# Altium schematic sheet Low Distortion Oscillator.Notch1.SchDoc
size A4
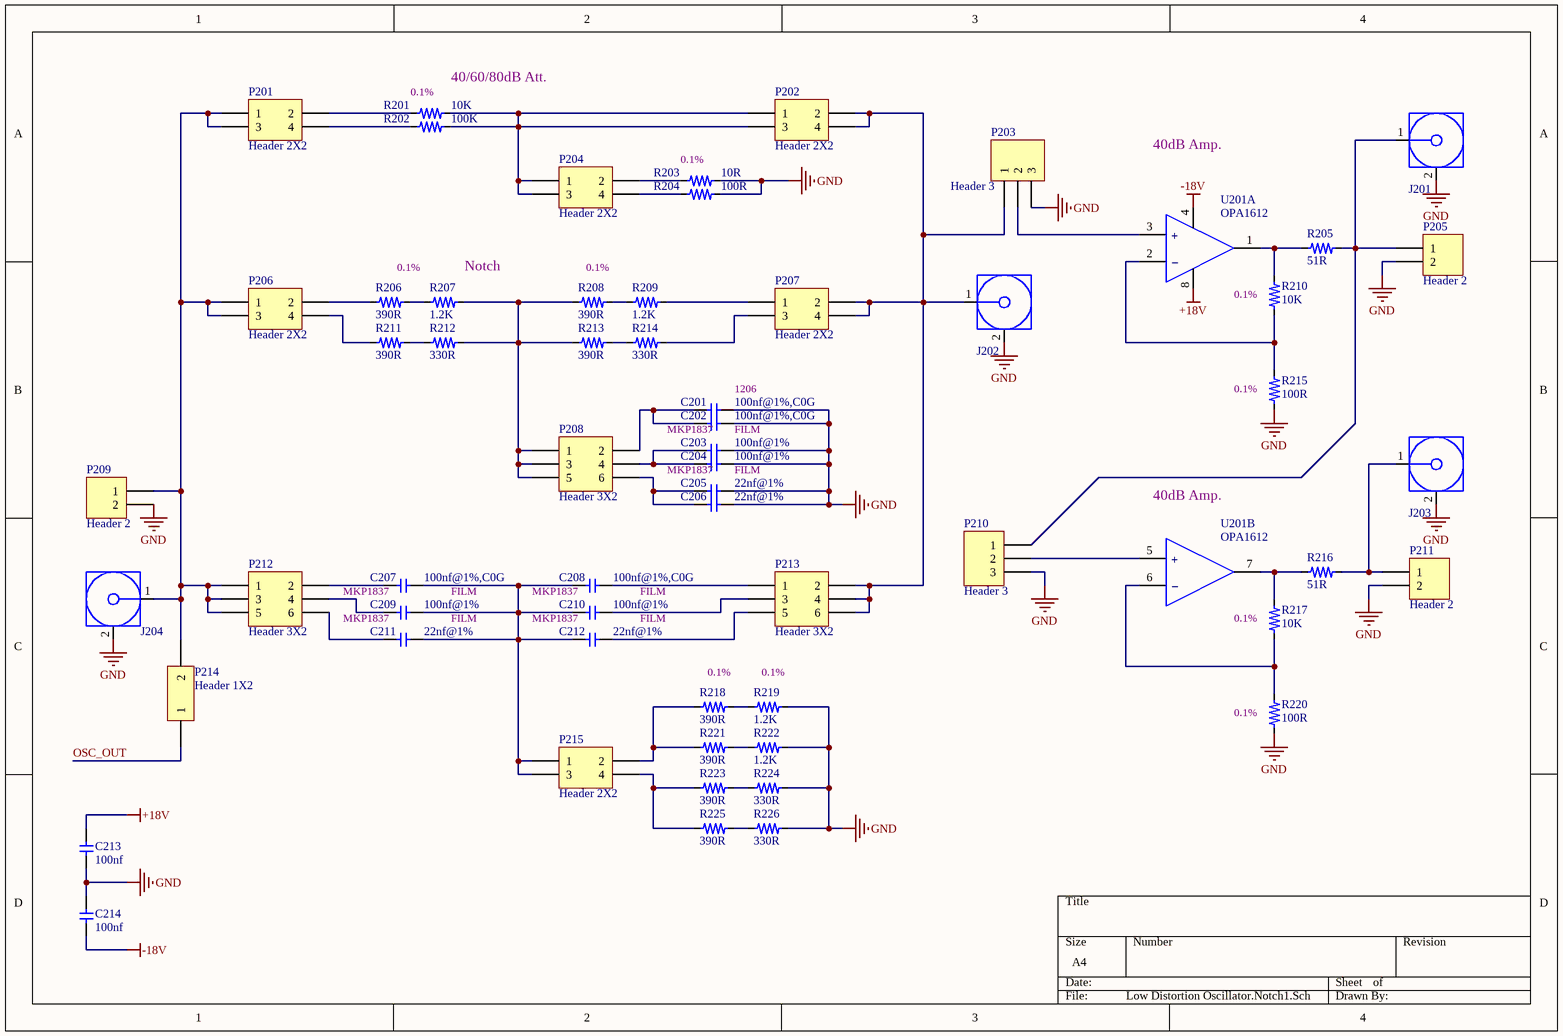
[diagram p0: Low Distortion Oscillator.Notch1.SchDoc]

## Parts
C201  value 100nf@1%,C0G  [C1206]  (hidden comment: Cap)
C202  value 100nf@1%,C0G  [C1206]  (hidden comment: Cap)
C203  value 100nf@1%  [CAP-FILM-7.2X8.5X10-P5X0.5]  (hidden comment: Cap-Film)
C204  value 100nf@1%  [CAP-FILM-7.2X8.5X10-P5X0.5]  (hidden comment: Cap-Film)
C205  value 22nf@1%  [CAP-FILM-7.2X5.5X7.0-P5X0.5]  (hidden comment: Cap-Film)
C206  value 22nf@1%  [CAP-FILM-7.2X5.5X7.0-P5X0.5]  (hidden comment: Cap-Film)
C207  value 100nf@1%,C0G  [C1206]  (hidden comment: Cap)
C208  value 100nf@1%,C0G  [C1206]  (hidden comment: Cap)
C209  value 100nf@1%  [CAP-FILM-7.2X8.5X10-P5X0.5]  (hidden comment: Cap-Film)
C210  value 100nf@1%  [CAP-FILM-7.2X8.5X10-P5X0.5]  (hidden comment: Cap-Film)
C211  value 22nf@1%  [CAP-FILM-7.2X5.5X7.0-P5X0.5]  (hidden comment: Cap-Film)
C212  value 22nf@1%  [CAP-FILM-7.2X5.5X7.0-P5X0.5]  (hidden comment: Cap-Film)
C213  value 100nf  [C0805]  (hidden comment: Cap)
C214  value 100nf  [C0805]  (hidden comment: Cap)
J201  SMA  [SMA-2]  (value not drawn)
J202  SMA  [SMA-2]  (value not drawn)
J203  SMA  [SMA-2]  (value not drawn)
J204  SMA  [SMA-2]  (value not drawn)
P201  Header 2X2  [HDR2X2]
P202  Header 2X2  [HDR2X2]
P203  Header 3  [HDR1X3]
P204  Header 2X2  [HDR2X2]
P205  Header 2  [HDR1X2]
P206  Header 2X2  [HDR2X2]
P207  Header 2X2  [HDR2X2]
P208  Header 3X2  [HDR2X3]
P209  Header 2  [HDR1X2]
P210  Header 3  [HDR1X3]
P211  Header 2  [HDR1X2]
P212  Header 3X2  [HDR2X3]
P213  Header 3X2  [HDR2X3]
P214  Header 1X2  [HDR2X1]
P215  Header 2X2  [HDR2X2]
R201  value 10K  [R0805]  (hidden comment: Res)
R202  value 100K  [R0805]  (hidden comment: Res)
R203  value 10R  [R0805]  (hidden comment: Res)
R204  value 100R  [R0805]  (hidden comment: Res)
R205  value 51R  [R0805]  (hidden comment: Res)
R206  value 390R  [R0805]  (hidden comment: Res)
R207  value 1.2K  [R0805]  (hidden comment: Res)
R208  value 390R  [R0805]  (hidden comment: Res)
R209  value 1.2K  [R0805]  (hidden comment: Res)
R210  value 10K  [R0805]  (hidden comment: Res)
R211  value 390R  [R0805]  (hidden comment: Res)
R212  value 330R  [R0805]  (hidden comment: Res)
R213  value 390R  [R0805]  (hidden comment: Res)
R214  value 330R  [R0805]  (hidden comment: Res)
R215  value 100R  [R0805]  (hidden comment: Res)
R216  value 51R  [R0805]  (hidden comment: Res)
R217  value 10K  [R0805]  (hidden comment: Res)
R218  value 390R  [R0805]  (hidden comment: Res)
R219  value 1.2K  [R0805]  (hidden comment: Res)
R220  value 100R  [R0805]  (hidden comment: Res)
R221  value 390R  [R0805]  (hidden comment: Res)
R222  value 1.2K  [R0805]  (hidden comment: Res)
R223  value 390R  [R0805]  (hidden comment: Res)
R224  value 330R  [R0805]  (hidden comment: Res)
R225  value 390R  [R0805]  (hidden comment: Res)
R226  value 330R  [R0805]  (hidden comment: Res)
U201  OPA1612  [OPA1612-SOIC8]  (parts A,B of 2)

## Nets
+18V: C213.2 U201.8(+Vs)
-18V: C214.1 U201.4(-Vs)
GND: C201.2 C202.2 C203.2 C204.2 C205.2 C206.2 C213.1 C214.2 J201.2(GND) J202.2(GND) J203.2(GND) J204.2(GND) P203.3 P205.2 P209.2 P210.3 P211.2 R203.1 R204.1 R215.1 R219.2 R220.1 R222.2 R224.2 R226.2
OSC_OUT: P214.1
NetC201_1: C201.1 C202.1 P208.2
NetC203_1: C203.1 C204.1 P208.4
NetC205_1: C205.1 C206.1 P208.6
NetC207_1: C207.1 P212.2
NetC207_2: C207.2 C208.1 C209.2 C210.1 C211.2 C212.1 P215.1 P215.3
NetC208_2: C208.2 P213.1
NetC209_1: C209.1 P212.4
NetC210_2: C210.2 P213.3
NetC211_1: C211.1 P212.6
NetC212_2: C212.2 P213.5
NetJ201_1: J201.1(Signal) P205.1 P210.1 R205.2
NetJ202_1: J202.1(Signal) P202.2 P202.4 P203.1 P207.2 P207.4 P213.2 P213.4 P213.6
NetJ203_1: J203.1(Signal) P211.1 R216.2
NetJ204_1: J204.1(Signal) P201.1 P201.3 P206.1 P206.3 P209.1 P212.1 P212.3 P212.5 P214.2
NetP201_2: P201.2 R201.1
NetP201_4: P201.4 R202.1
NetP202_1: P202.1 P202.3 P204.1 P204.3 R201.2 R202.2
NetP203_2: P203.2 U201.3(+IN_A)
NetP204_2: P204.2 R203.2
NetP204_4: P204.4 R204.2
NetP206_2: P206.2 R206.1
NetP206_4: P206.4 R211.1
NetP207_1: P207.1 R209.2
NetP207_3: P207.3 R214.2
NetP208_1: P208.1 P208.3 P208.5 R207.2 R208.1 R212.2 R213.1
NetP210_2: P210.2 U201.5(+IN_B)
NetP215_2: P215.2 R218.1 R221.1
NetP215_4: P215.4 R223.1 R225.1
NetR205_1: R205.1 R210.2 U201.1(OUT_A)
NetR206_2: R206.2 R207.1
NetR208_2: R208.2 R209.1
NetR210_1: R210.1 R215.2 U201.2(-IN_A)
NetR211_2: R211.2 R212.1
NetR213_2: R213.2 R214.1
NetR216_1: R216.1 R217.2 U201.7(OUT_B)
NetR217_1: R217.1 R220.2 U201.6(-IN_B)
NetR218_2: R218.2 R219.1
NetR221_2: R221.2 R222.1
NetR223_2: R223.2 R224.1
NetR225_2: R225.2 R226.1

## Notes on the sheet
- (near R201) 0.1%
- 40/60/80dB Att.
- (near R203) 0.1%
- 40dB Amp.
- 0.1%
- (near R207) Notch
- (near C202) MKP1837
- 1206
- FILM
- (near R215) 0.1%
- (near C204) MKP1837
- MKP1837
- (near R220) 0.1%
- (in symbol OPA1612, part A) +; –
- (in symbol OPA1612, part B) +; –

## Library data of the parts
P201 P202 P204 P206 P207 P215 = Header 2X2: Header, 2-Pin, Dual row
P203 P210 = Header 3: Header, 3-Pin
P205 P209 P211 = Header 2: Header, 2-Pin
P208 P212 P213 = Header 3X2: Header, 3-Pin, Dual row
P214 = Header 1X2: Header, 1-Pin, Dual row
R201-R226 = Res: 电阻
U201 = OPA1612: OPA161x SoundPlus™ High-Performance, Bipolar-Input Audio Operational Amplifiers